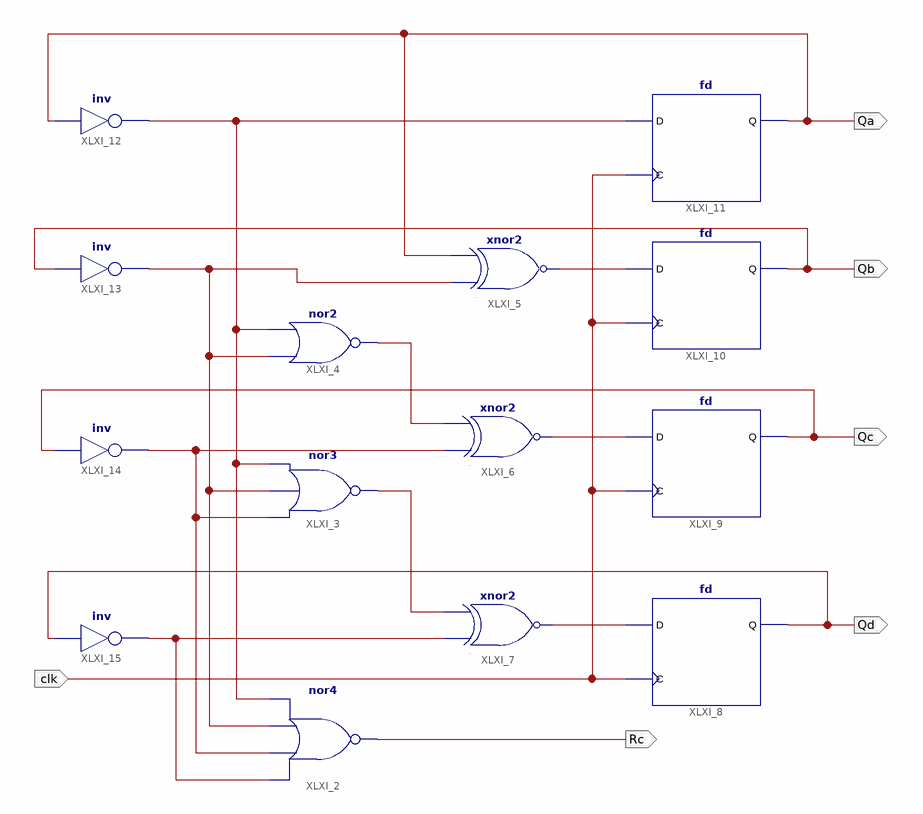
[diagram p0: schematic sheet 1]
// Xilinx ISE schematic Counter4b.sch (kintex7) as structural Verilog: 14 symbols, 6 ports
module Counter4b (
  input  clk,
  output Rc,
  output Qb,
  output Qc,
  output Qd,
  output Qa
);

  wire XLXN_4, XLXN_14, XLXN_15, XLXN_16, XLXN_17, XLXN_18, XLXN_19, XLXN_25, XLXN_26;

  nor XLXI_2 (Rc, XLXN_14, XLXN_15, XLXN_16, XLXN_17);
  nor XLXI_3 (XLXN_18, XLXN_15, XLXN_16, XLXN_17);
  nor XLXI_4 (XLXN_25, XLXN_16, XLXN_17);
  xnor XLXI_5 (XLXN_4, XLXN_16, Qa);
  xnor XLXI_6 (XLXN_26, XLXN_15, XLXN_25);
  xnor XLXI_7 (XLXN_19, XLXN_14, XLXN_18);
  fd XLXI_8 (.C(clk), .D(XLXN_19), .Q(Qd));
  fd XLXI_9 (.C(clk), .D(XLXN_26), .Q(Qc));
  fd XLXI_10 (.C(clk), .D(XLXN_4), .Q(Qb));
  fd XLXI_11 (.C(clk), .D(XLXN_17), .Q(Qa));
  not XLXI_12 (XLXN_17, Qa);
  not XLXI_13 (XLXN_16, Qb);
  not XLXI_14 (XLXN_15, Qc);
  not XLXI_15 (XLXN_14, Qd);
endmodule
